# EAGLE design Generador de Funciones v2 (EAGLE 9.0.1)
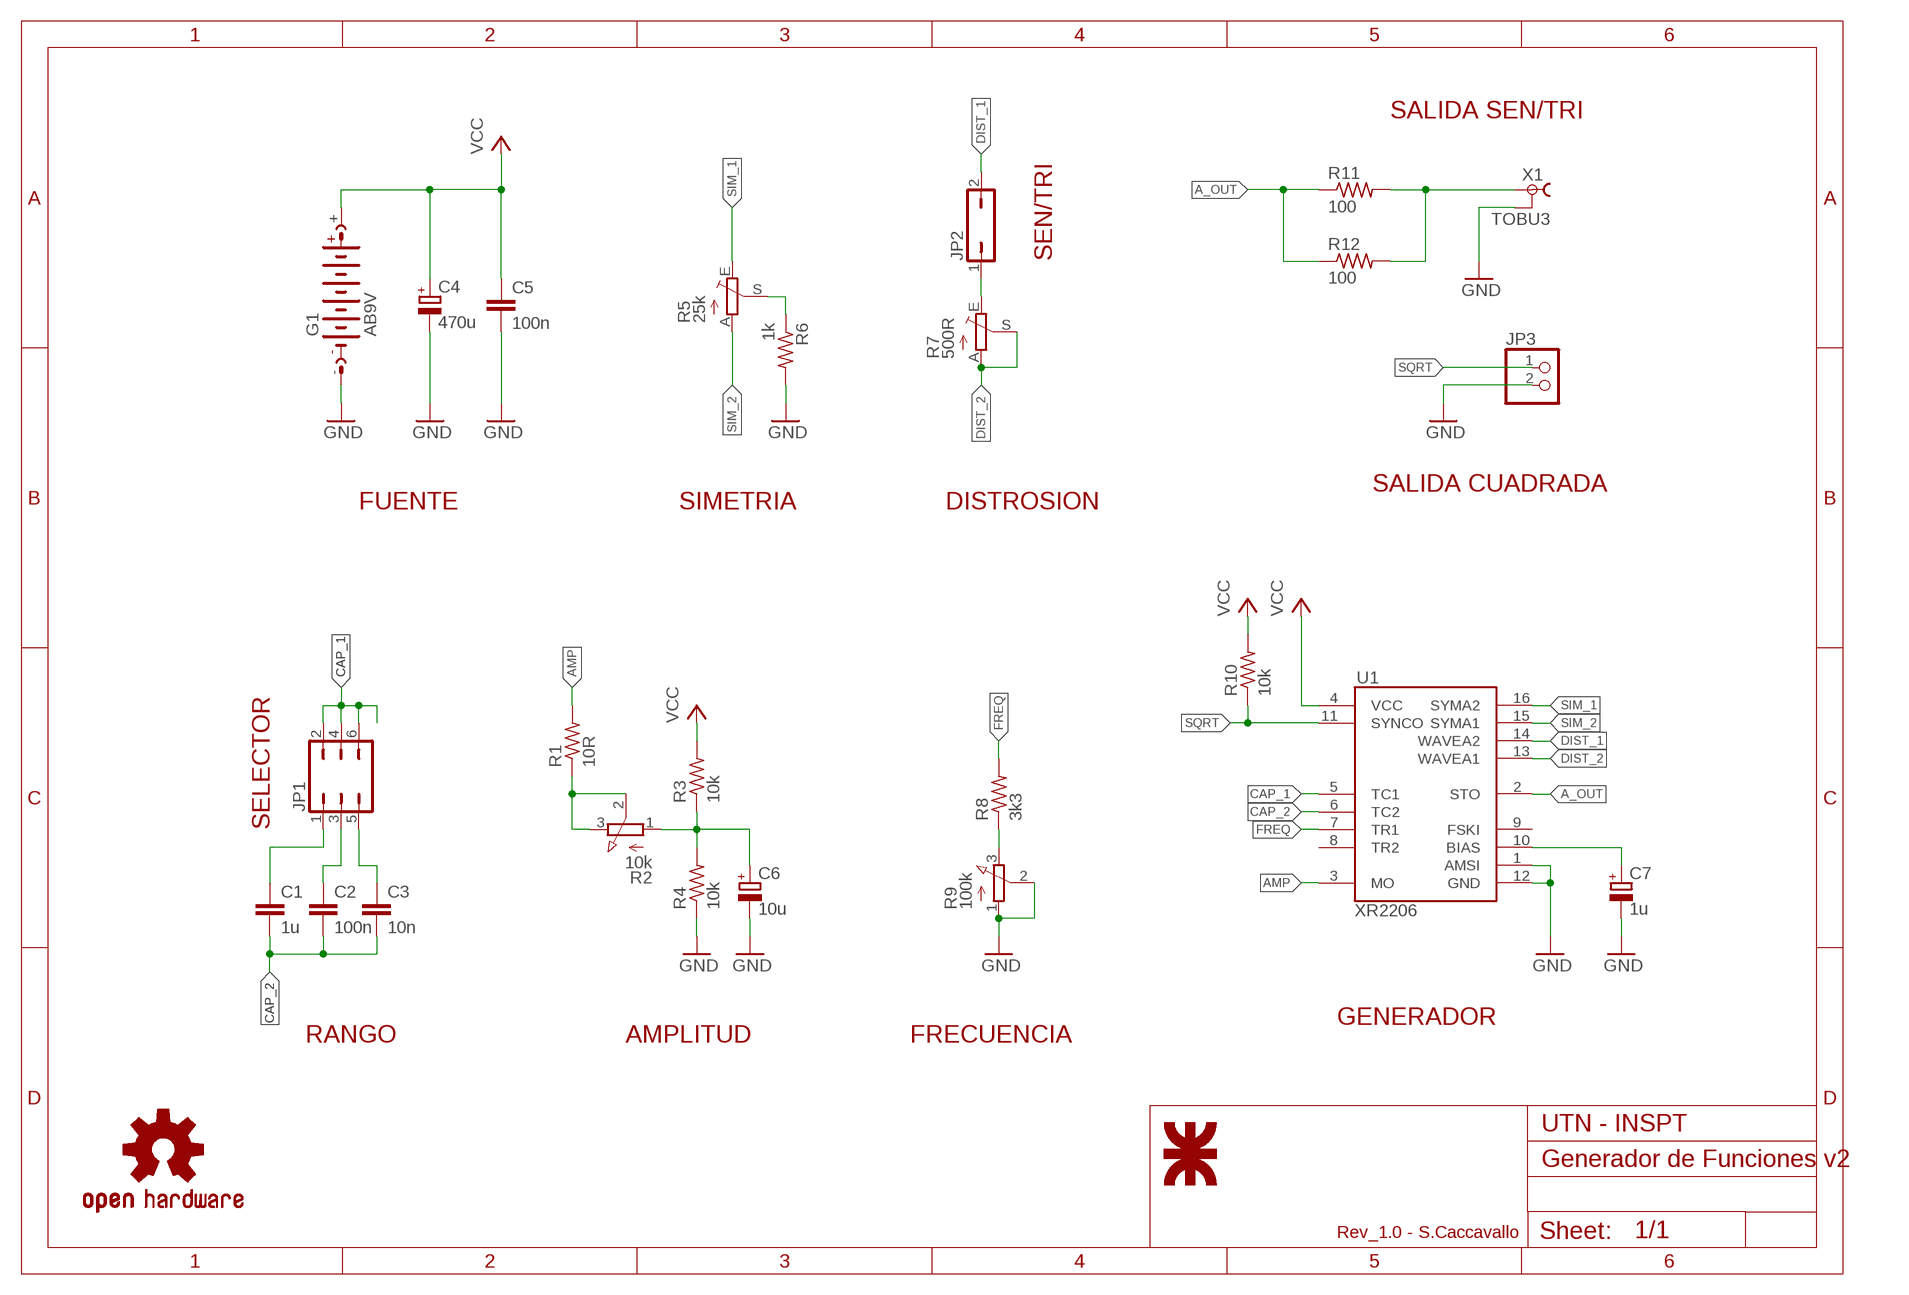
[diagram p0: schematic, sheet 1]

## Parts
C1  1u  C-EU050-024X044  [C050-024X044]
C2  100n  C-EU050-024X044  [C050-024X044]
C3  10n  C-EU050-024X044  [C050-024X044]
C4  470u  CPOL-EUE3.5-8  [E3,5-8]
C5  100n  C-EU050-024X044  [C050-024X044]
C6  10u  CPOL-EUE2.5-6  [E2,5-6]
C7  1u  CPOL-EUE2.5-6  [E2,5-6]
G1  AB9V  [AB9V]
JP1  JP3Q  [JP3Q]
JP2  JP1Q  [JP1]
JP3  PINHD-1X2  [1X02]
R1  10R  R-US_0207/10  [0207/10]
R2  10k  3RP/1610N  [3RP/1610N]
R3  10k  R-US_0207/10  [0207/10]
R4  10k  R-US_0207/10  [0207/10]
R5  25k  TRIM_EU-RJ9W  [RJ9W]
R6  1k  R-US_0207/10  [0207/10]
R7  500R  TRIM_EU-RJ9W  [RJ9W]
R8  3k3  R-US_0207/10  [0207/10]
R9  100k  3RP/1610N  [3RP/1610N]
R10  10k  R-US_0207/10  [0207/10]
R11  100  R-US_0207/10  [0207/10]
R12  100  R-US_0207/10  [0207/10]
U1  XR2206  [DIL16]
U$1  UTN_LOGO_0  [UTN_LOGO_0_TOP]
U$4  OSHW-LOGOM  [OSHW-LOGO-M]
X1  TOBU3  [TOBU3]

## Nets
A_OUT: R11.1 R12.1 U1.2(STO)
AMP: R1.2 U1.3(MO)
CAP_1: JP1.2 JP1.4 JP1.6 U1.5(TC1)
CAP_2: C1.2 C2.2 C3.2 U1.6(TC2)
DIST_1: JP2.2 U1.14(WAVEA2)
DIST_2: R7.A R7.S U1.13(WAVEA1)
FREQ: R8.2 U1.7(TR1)
GND: C4.- C5.2 C6.- C7.- G1.- JP3.2 R4.1 R6.2 R9.1(A) R9.2(S) U1.1(AMSI) U1.12(GND) X1.2 X1.2@1 X1.2@2
N$1: R1.1 R2.2(S) R2.3(E)
N$3: R8.1 R9.3(E)
N$5: C1.1 JP1.1
N$6: C2.1 JP1.3
N$7: C7.+ U1.10(BIAS)
N$8: R5.S R6.1
N$9: C3.1 JP1.5
N$11: R11.2 R12.2 X1.1
N$13: JP2.1 R7.E
N$15: C6.+ R2.1(A) R3.1 R4.2
SIM_1: R5.E U1.16(SYMA2)
SIM_2: R5.A U1.15(SYMA1)
SQRT: JP3.1 R10.1 U1.11(SYNCO)
VCC: C4.+ C5.1 G1.+ R3.2 R10.2 U1.4(VCC)
Unconnected: U1.8(TR2) U1.9(FSKI)

## Notes on the sheet
- SALIDA SEN/TRI
- SEN/TRI
- SALIDA CUADRADA
- FUENTE | SIMETRIA | DISTROSION
- SELECTOR
- GENERADOR
- RANGO | AMPLITUD | FRECUENCIA
- UTN - INSPT
- Rev_1.0 - S.Caccavallo

## Library data of the parts
C1-C3 C5 = rcl:C-EU: CAPACITOR, European symbol; SPICEPREFIX: C
C4 C6 C7 = rcl:CPOL-EU: POLARIZED CAPACITOR, European symbol; SPICEPREFIX: C
G1 = battery:AB9V: 9-V BATTERY CLIP
JP1 = jumper:JP3Q: JUMPER
JP2 = jumper:JP1Q: JUMPER
JP3 = pinhead:PINHD-1X2: PIN HEADER
R1 R3 R4 R6 R8 R10-R12 = rcl:R-US_: RESISTOR, American symbol; SPICEPREFIX: R
R2 R9 = pot:3RP/1610N: 16mm Potentiometer one level Source: http://www.alphapotentiometers.net/html/16mm_pot_2.html
R5 R7 = pot:TRIM_EU-: POTENTIOMETER
U1 = SparkFun:XR2206: XR2206 Monolithic Function Generator
U$1 = UTN_LOGO:UTN_LOGO_0
U$4 = SparkFun-Aesthetics:OSHW-LOGO: Open Source Hardware Logo This logo indicates the piece of hardware it is found on incorporates a OSHW license and/or adheres to the definition of open source hardware found here: http://freedomdefined.org/OSHW
X1 = con-hirschmann:TOBU3: Female Cinch CONNECTOR ( RCA Jack ); MF: FARNELL; MPN: TOBU 3; OC_FARNELL: 592791; OC_NEWARK: 06WX5914

## Board
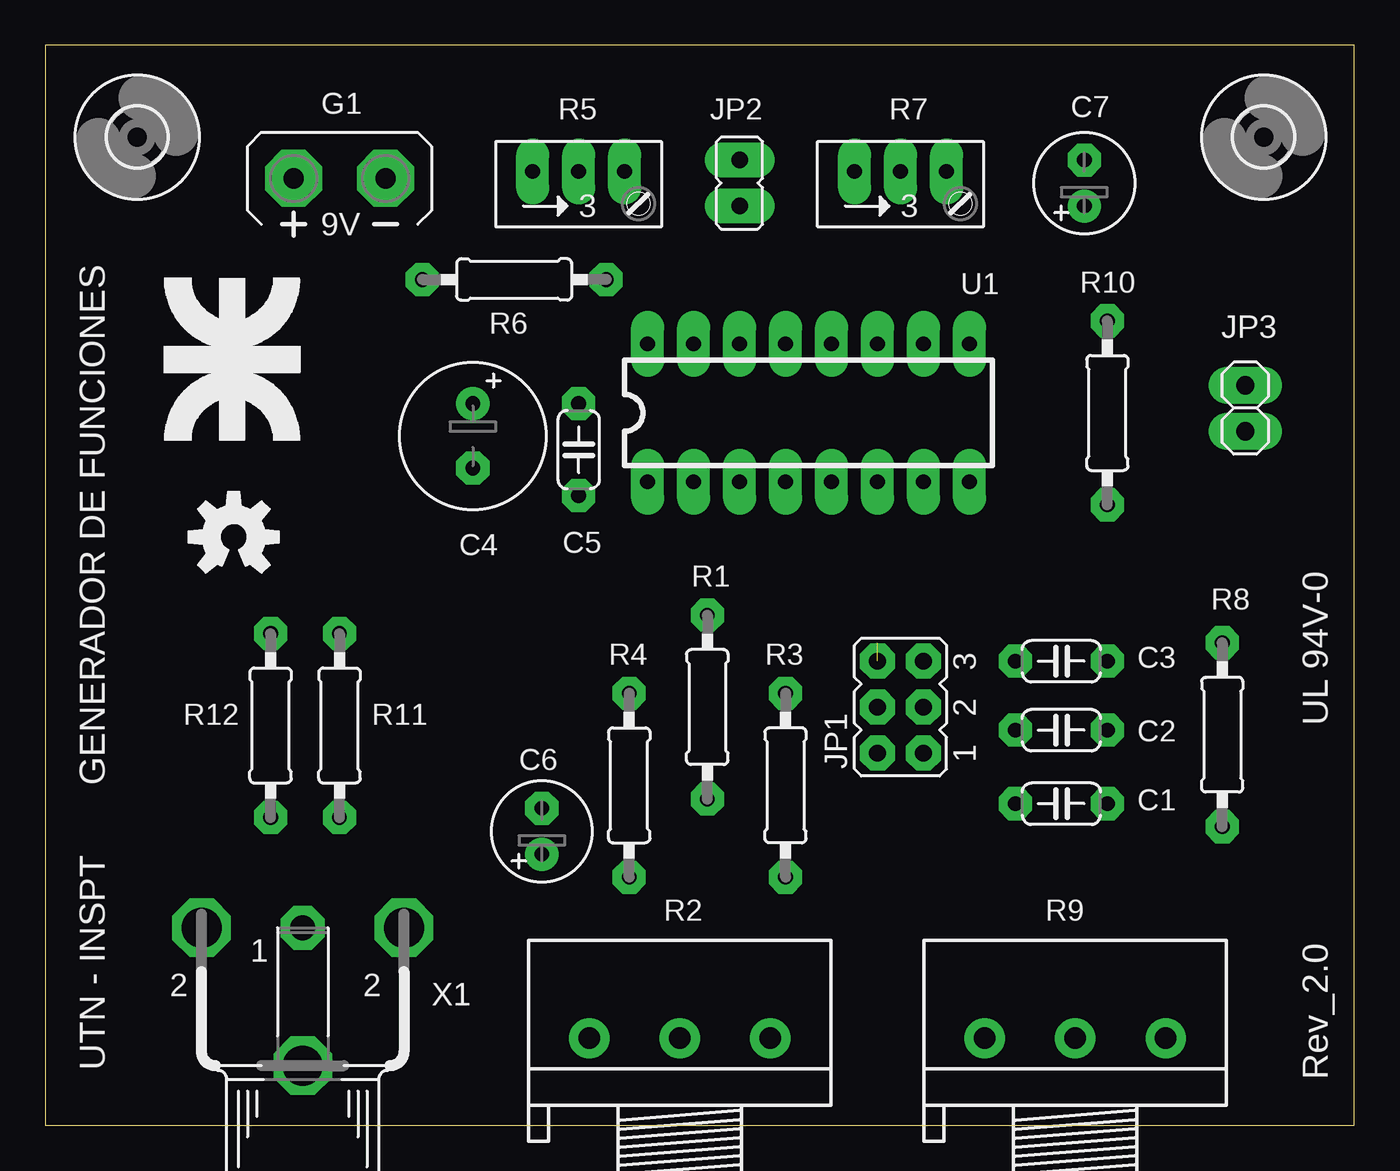
[diagram p1: board, top side]
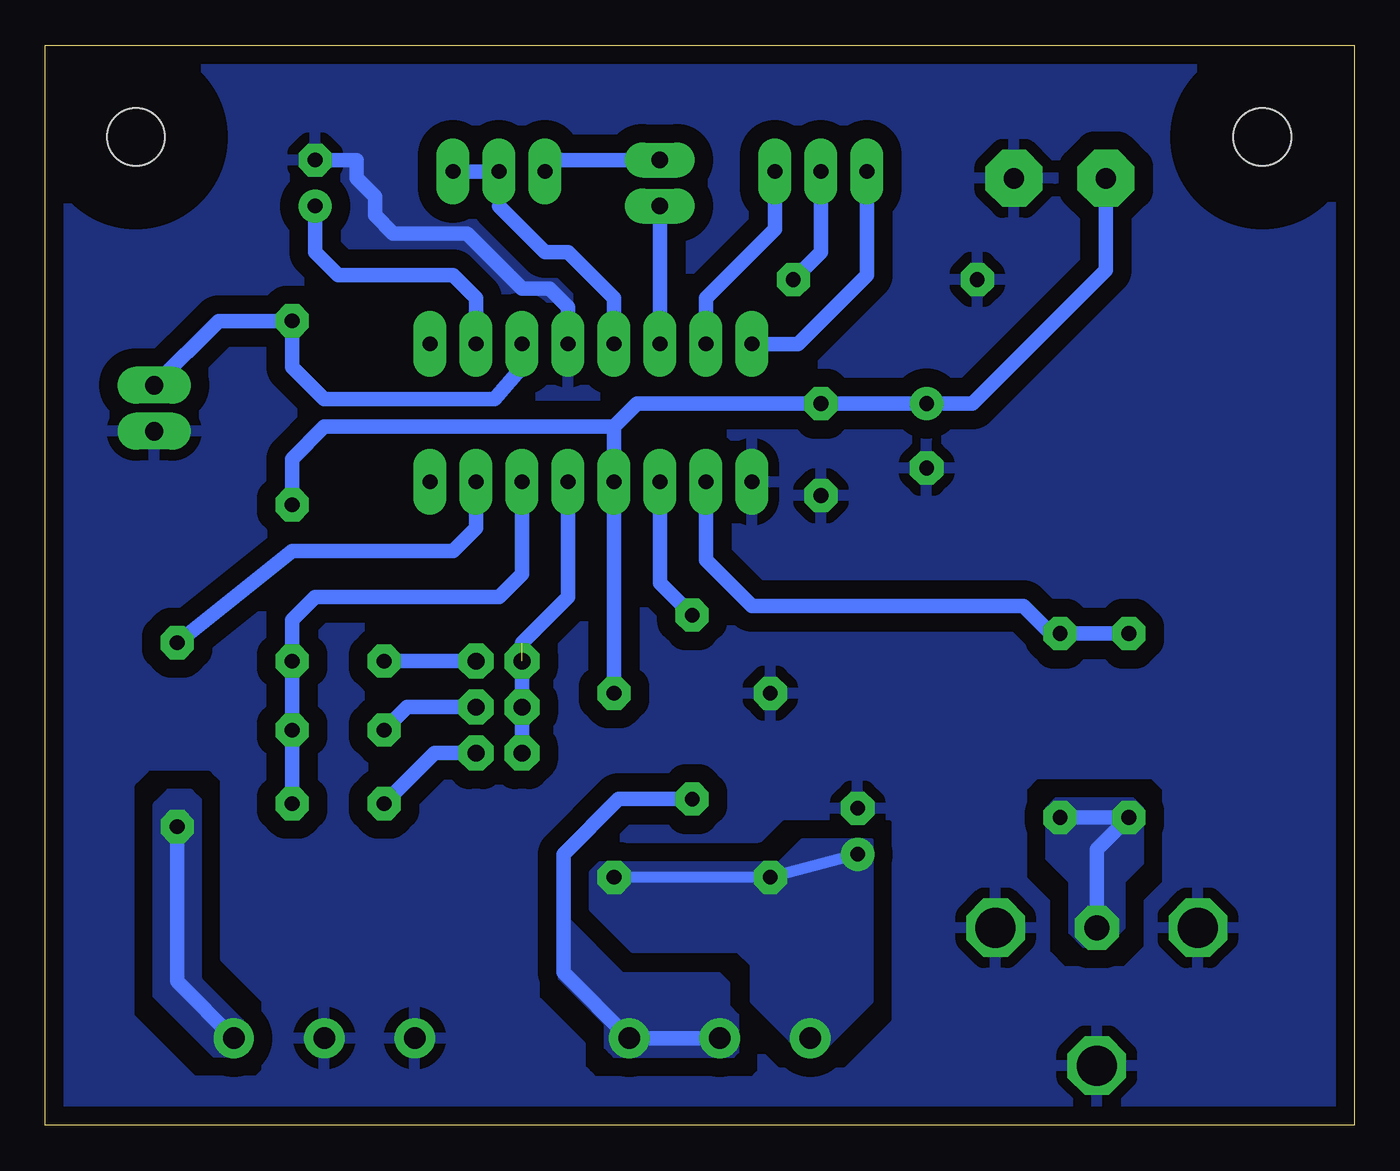
[diagram p2: board, bottom side, seen from below]

Size 72.31 x 59.68 mm. Coordinates in mm from the lower left corner, seen from the top.
Outline: 0,0 72.31,0 72.31,59.68 0,59.68 0,0
Copper layers (1*16): Top 0.035mm / dielectric 1.5mm / Bottom 0.035mm
Design rules "default *": minimum track width 24mil, minimum drill 0.35mm, track to track 6mil, track to pad 6mil, pad to pad 6mil, via to via 6mil, smd to smd 6mil, copper to edge 40mil, drill to drill 24mil, minimum pad ring 20mil, minimum via ring 20mil, stop-mask expansion 4mil, vias tented up to drill 0mil, thermal gap 24mil

### Footprints (pad centres in the part's own frame; a part is rotated, then mirrored left to right if it is on the bottom)
C050-024X044 = drill 0.813 octagon: 1 -2.54,0; 2 2.54,0
E3,5-8 = drill 0.813 pad 1.6: + -1.778,0 | drill 0.813 pad 1.6 octagon: - 1.778,0
E2,5-6 = drill 0.813 pad 1.6: + -1.27,0 | drill 0.813 pad 1.6 octagon: - 1.27,0
AB9V = drill 1.118 pad 3.15 octagon: + 0,2.54; - 0,-2.54
JP3Q = drill 0.914 octagon: 1 -2.54,-1.27; 2 -2.54,1.27; 3 0,-1.27; 4 0,1.27; 5 2.54,-1.27; 6 2.54,1.27
JP1 = drill 0.914 long: 1 0,-1.27; 2 0,1.27
1X02 = drill 1.016 long: 1 -1.27,0; 2 1.27,0
0207/10 = drill 0.813 octagon: 1 -5.08,0; 2 5.08,0
3RP/1610N = drill 1.2 pad 2.184: 1 -5,0; 2 0,0; 3 5,0
RJ9W = drill 0.813 long: A 2.54,0.635; E -2.54,0.635; S 0,0.635
DIL16 = drill 0.813 long: 1 -8.89,-3.81; 2 -6.35,-3.81; 3 -3.81,-3.81; 4 -1.27,-3.81; 5 1.27,-3.81; 6 3.81,-3.81; 7 6.35,-3.81; 8 8.89,-3.81; 9 8.89,3.81; 10 6.35,3.81; 11 3.81,3.81; 12 1.27,3.81; 13 -1.27,3.81; 14 -3.81,3.81; 15 -6.35,3.81; 16 -8.89,3.81
3,2 = hole 3.2: 0,0
TOBU3 = drill 1.397 octagon: 1 0,-2.54 | drill 2.21 octagon: 2 5.588,-2.54; 2@1 -5.588,-2.54; 2@2 0,5.08

### Placement (x,y rotation side)
C1  56.13,17.78 0 top
C2  56.13,21.84 0 top
C3  56.13,25.65 0 top
C4  23.62,38.1 270 top
C5  29.46,37.34 270 top
C6  27.43,16.26 90 top
C7  57.4,52.07 90 top
G1  16.26,52.32 90 top
JP1  47.24,23.11 90 top
JP2  38.35,52.07 180 top
JP3  66.29,39.62 270 top
R1  36.58,23.11 90 top
R2  35.05,4.83 0 top
R3  40.89,18.8 90 top
R4  32.26,18.8 270 top
R5  29.46,52.07 0 top
R6  25.91,46.74 180 top
R7  47.24,52.07 0 top
R8  65.02,21.59 90 top
R9  56.9,4.83 0 top
R10  58.67,39.37 270 top
R11  16.26,22.1 270 top
R12  12.45,22.1 270 top
U1  42.16,39.37 0 top
U$1  5.84,37.85 0 top
U$2  [3,2]  5.08,54.61 0 top
U$3  [3,2]  67.31,54.61 0 top
U$4  10.41,32.51 0 top
X1  14.22,8.38 180 top

### Tracks (layer width: path | path; a pad name or v marks a point on that pad's centre or on a via)
A_OUT
  Bottom 0.813: R12.1 R11.1 16.76,27.18 18.29,28.7 33.27,28.7 35.81,31.24 U1.2
AMP
  Bottom 0.813: R1.2 38.35,29.97 U1.3
CAP_1  (1 unrouted)
  Bottom 0.813: U1.5 43.43,29.21 45.97,26.67 | JP1.6 JP1.4 JP1.2
CAP_2
  Bottom 0.813: U1.6 45.97,30.48 47.24,29.21 57.4,29.21 58.67,27.94 C3.2 C2.2 C1.2
DIST_1
  Bottom 0.813: JP2.2 U1.14
DIST_2
  Bottom 0.61: 47.24,50.8 R7.S
  Bottom 0.813: U1.13 40.89,45.72 43.43,48.26 44.7,48.26 47.24,50.8 | R7.S R7.A
FREQ
  Bottom 0.813: U1.7 48.51,33.02 49.78,31.75 58.67,31.75 R8.2
GND
  Bottom 0.813: U1.12 43.43,45.21 44.45,46.23 45.97,46.23 49.02,49.28 53.09,49.28 54.1,50.29 54.1,51.31 55.12,52.32 55.12,53.34 C7.-
  pour Bottom (isolate 1.016, rank 6): -5.08,63.5 76.45,63.75 76.45,-4.83 -5.08,-5.08
N$1
  Bottom 0.813: R1.1 40.64,18.03 43.69,14.99 43.69,8.46 R2.3 R2.2
  pour Bottom (no thermals): 34.04,4.32 34.04,6.1 34.54,6.6 34.54,7.87 35.05,8.38 39.88,8.38 40.39,8.38 43.43,11.43 43.69,11.43 43.94,11.18 43.94,8.38 43.94,8.13 41.4,5.59 41.4,4.32 41.15,4.06 40.89,3.81 34.29,3.81 34.04,4.06
N$2
  pour Bottom (no thermals): 39.62,3.81 40.53,3.81 arc45 40.71,3.88 39.12,4.42 arc45 39.19,4.24
N$3
  Bottom 0.813: R8.1 65.02,8.06 arc-45 64.95,7.88 R9.3
  pour Bottom (no thermals): 61.72,3.81 62.89,3.81 arc45 63.07,3.88 66.29,7.11 66.29,17.67 arc45 66.22,17.85 65.53,18.54 64.37,18.54 arc45 64.19,18.47 63.75,18.03 63.75,8.23 arc-45 63.68,8.05 61.47,5.84 61.47,4.17 arc45 61.54,3.99
N$5
  Bottom 0.813: JP1.1 50.8,20.57 C1.1
N$6
  Bottom 0.813: JP1.3 52.32,23.11 C2.1
N$7
  Bottom 0.813: U1.10 48.51,45.72 49.78,46.99 56.13,46.99 57.4,48.26 C7.+
N$8
  Bottom 0.813: R5.S 29.46,48.26 R6.1
N$9
  Bottom 0.813: JP1.5 C3.1
N$11
  Bottom 0.813: X1.1 14.22,15.24 R12.2 R11.2
  pour Bottom (no thermals): 13.72,9.91 12.7,10.92 12.7,13.46 11.68,14.48 11.68,17.53 12.19,18.03 16.51,18.03 17.02,17.53 17.02,14.73 15.75,13.46 15.75,10.67 14.99,9.91
N$13
  Bottom 0.813: JP2.1 44.07,53.34 R7.E
N$15
  Bottom 0.61: R3.1 R4.2 C6.+
  pour Bottom (no thermals): 29.21,4.32 26.67,6.86 26.67,15.75 30.48,15.75 31.75,14.48 41.66,14.48 42.16,13.97 42.16,11.94 39.88,9.65 34.04,9.65 33.27,8.89 33.27,6.86 30.73,4.32
SIM_1
  Bottom 0.813: U1.16 30.73,43.18 26.92,46.99 R5.E
SIM_2
  Bottom 0.813: R5.A 32,49.53 35.81,45.72 U1.15
SQRT
  Bottom 0.61: U1.11 45.97,41.91
  Bottom 0.813: 45.97,41.91 47.5,40.13 56.9,40.13 58.67,41.91 R10.1 62.74,44.45 JP3.1
VCC
  Bottom 0.813: 40.89,38.61 U1.4 R3.2 | 40.89,38.61 39.62,39.88 C5.1 C4.+ 21.08,39.88 13.72,47.24 G1.+ | R10.2 58.67,36.83 56.9,38.61 40.89,38.61

### Text on the board
tNames: UL 94V-0 | GENERADOR DE FUNCIONES | UTN - INSPT | Rev_2.0